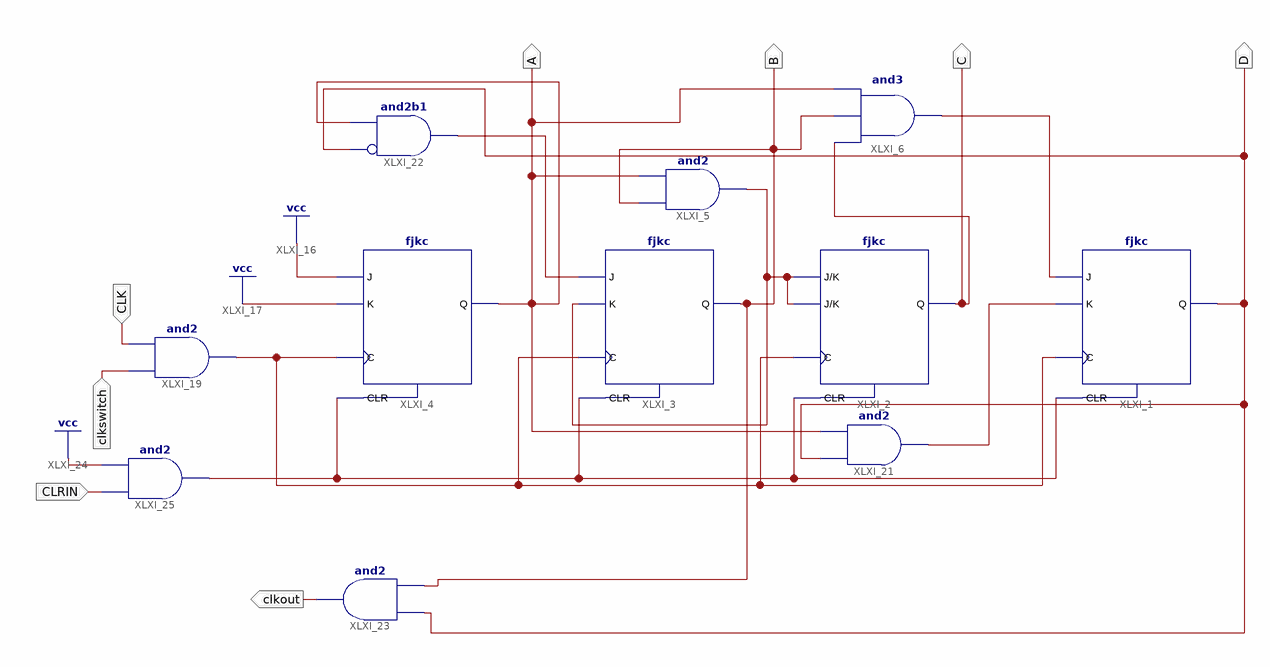
[diagram p0: schematic sheet 1]
// Xilinx ISE schematic FF09CLKCLRSW.sch (spartan6) as structural Verilog: 11 symbols, 8 ports
module FF09CLKCLRSW (
  input  CLK,
  input  clkswitch,
  input  CLRIN,
  output A,
  output C,
  output B,
  output D,
  output clkout
);

  wire XLXN_1, XLXN_10, XLXN_17, XLXN_29, XLXN_38, XLXN_42;

  fjkc XLXI_1 (.C(XLXN_10), .CLR(XLXN_29), .J(XLXN_1), .K(XLXN_42), .Q(D));
  fjkc XLXI_2 (.C(XLXN_10), .CLR(XLXN_29), .J(XLXN_38), .K(XLXN_38), .Q(C));
  fjkc XLXI_3 (.C(XLXN_10), .CLR(XLXN_29), .J(XLXN_17), .K(XLXN_38), .Q(B));
  fjkc XLXI_4 (.C(XLXN_10), .CLR(XLXN_29), .J(1'b1), .K(1'b1), .Q(A));
  and XLXI_5 (XLXN_38, B, A);
  and XLXI_19 (XLXN_10, clkswitch, CLK);
  and XLXI_6 (XLXN_1, C, B, A);
  and XLXI_21 (XLXN_42, D, A);
  and XLXI_22 (XLXN_17, ~D, A);  // and2b1
  and XLXI_23 (clkout, D, B);
  and XLXI_25 (XLXN_29, CLRIN, 1'b1);
endmodule
